# Altium schematic sheet powersupply.SchDoc
size A
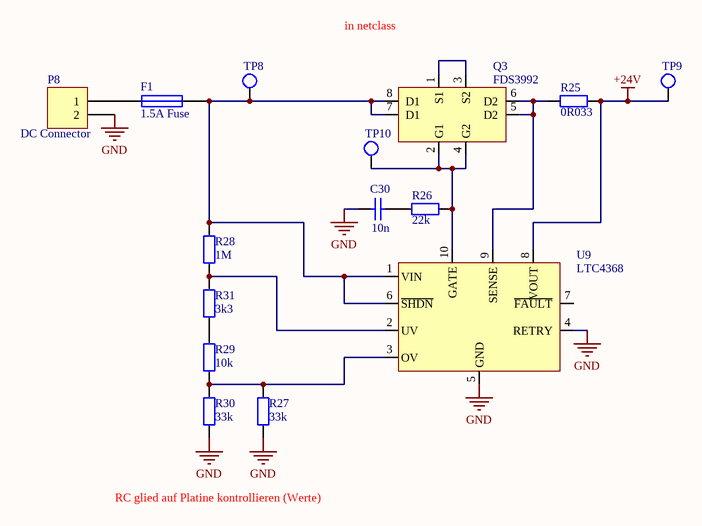
[diagram p0: powersupply.SchDoc]

## Parts
C30  value 10n  [6-0805_M]  (hidden comment: Cap)
F1  1.5A Fuse  [OMNI_BLOK_FUSE]
P8  DC Connector  [HDR1X2]
Q3  FDS3992  [SOIC-8]
R25  value 0R033  [C1206]  (hidden comment: Res2)
R26  value 22k  [6-0805_M]  (hidden comment: Res2)
R27  value 33k  [6-0805_M]  (hidden comment: Res2)
R28  value 1M  [6-0805_M]  (hidden comment: Res2)
R29  value 10k  [6-0805_M]  (hidden comment: Res2)
R30  value 33k  [6-0805_M]  (hidden comment: Res2)
R31  value 3k3  [6-0805_M]  (hidden comment: Res2)
TP8  TestPoint  [MEASUREMENT_POINT]  (value not drawn)
TP9  TestPoint  [MEASUREMENT_POINT]  (value not drawn)
TP10  TestPoint  [MEASUREMENT_POINT]  (value not drawn)
U9  LTC4368  [MSOP-10]

## Nets
+24V: R25.2 TP9.1 U9.8(VOUT)
GND: C30.1 P8.2 R27.1 R30.1 U9.4(RETRY) U9.5(GND)
NetC30_2: C30.2 R26.1
NetF1_1: F1.1 P8.1
NetF1_2: F1.2 Q3.7(D1) Q3.8(D1) R28.2 TP8.1 U9.1(VIN) U9.6(~{SHDN})
NetQ3_1: Q3.1(S1) Q3.3(S2)
NetQ3_2: Q3.2(G1) Q3.4(G2) R26.2 TP10.1 U9.10(GATE)
NetQ3_5: Q3.5(D2) Q3.6(D2) R25.1 U9.9(SENSE)
NetR27_2: R27.2 R29.1 R30.2 U9.3(OV)
NetR28_1: R28.1 R31.2 U9.2(UV)
NetR29_2: R29.2 R31.1

Not connected (* = marked no-connect by the designer): U9 7(~{FAULT})

## Notes on the sheet
- in netclass
- RC glied auf Platine kontrollieren (Werte)

## Library data of the parts
C30 = Cap: Capacitor; Published: 8-Jun-2000; LatestRevisionDate: 17-Jul-2002; LatestRevisionNote: Re-released for DXP Platform.; PackageReference: RAD-0.3; Publisher: Altium Limited; PackageDescription: Radial Cap, Thru-Hole; 2 Leads; 0.3 in Pin Spacing
F1 = Fuse 1: Fuse; Published: 8-Jun-2000; LatestRevisionDate: 17-Jul-2002; LatestRevisionNote: Re-released for DXP Platform.; PackageReference: PIN-W2/E2.8; Publisher: Altium Limited; PackageDescription: Thru-Hole; 2 Leads
P8 = Header 2: Header, 2-Pin; LatestRevisionDate: 17-Jul-2002; LatestRevisionNote: Re-released for DXP Platform.; Publisher: Altium Limited
Q3 = FDS3992: FDS3992 Dual N-Channel MOSFET
R25-R31 = Res2: Resistor; Published: 8-Jun-2000; LatestRevisionDate: 17-Jul-2002; LatestRevisionNote: Re-released for DXP Platform.; PackageReference: AXIAL-0.4; Publisher: Altium Limited; PackageDescription: Axial Device, Thru-Hole; 2 Leads; 0.4 in Pin Spacing
U9 = LTC4368: LTC4368 UV/OV/Reverse Protection IC